# EAGLE design PlantMonitor (EAGLE 8.3.2)
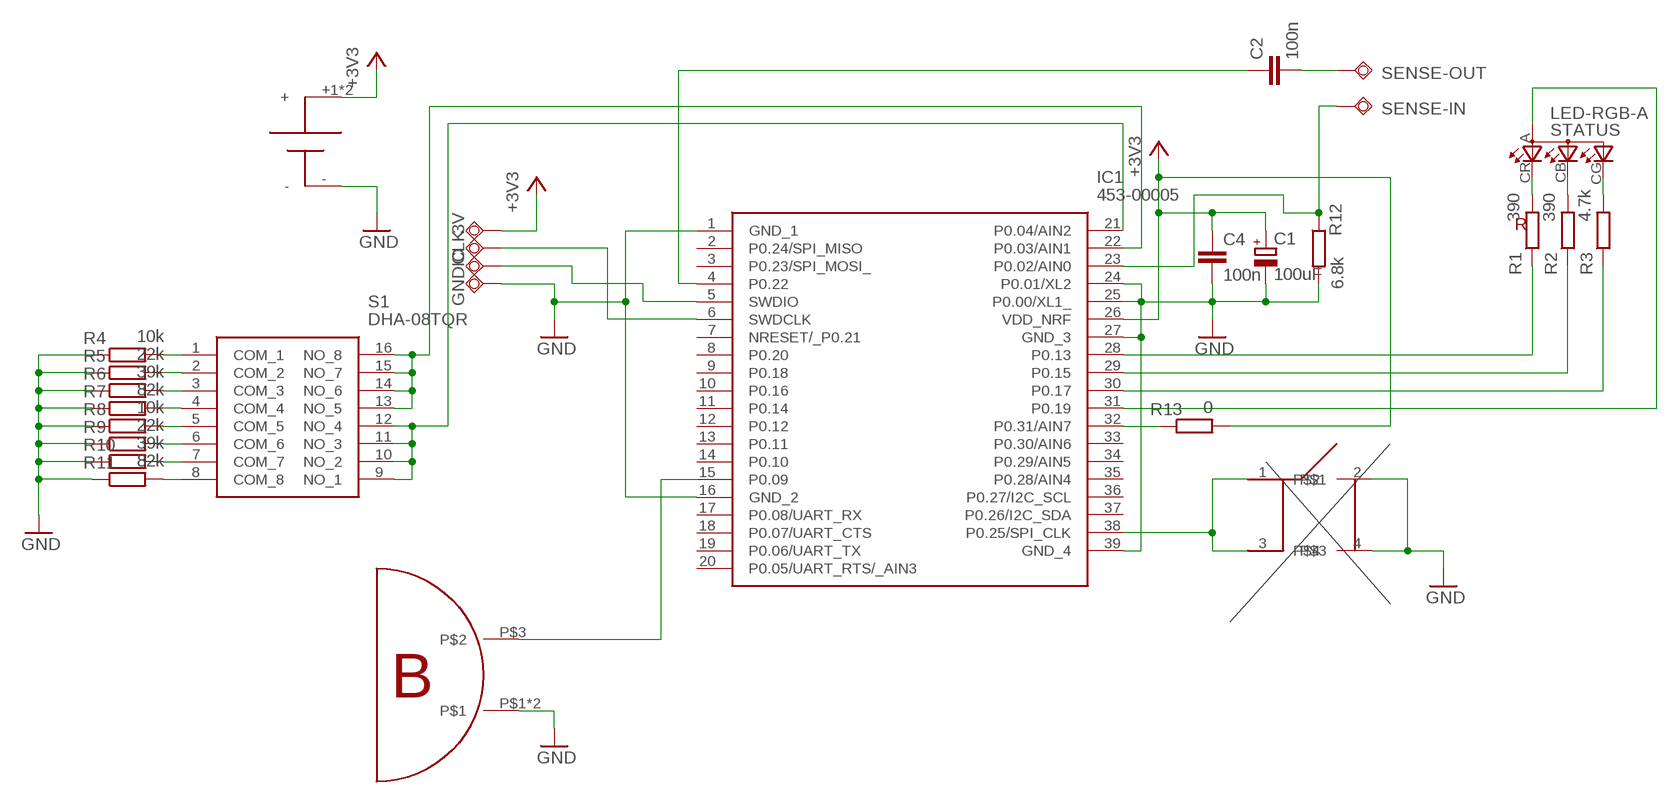
[diagram p0: schematic, sheet 1]

## Parts
3V  TPSQB1,27  [B1,27]
C1  100uF  CPOL-EUA/3216-18W  [A/3216-18W]
C2  100n  C-EUC0603K  [C0603K]
C4  100n  C-EUC0603K  [C0603K]
CLK  TPSQB1,27  [B1,27]
GND  TPSQB1,27  [B1,27]
IC1  453-00005  [45300005]
IO  TPSQB1,27  [B1,27]
R1  390  R-EU_R0603  [R0603]
R2  390  R-EU_R0603  [R0603]
R3  4.7k  R-EU_R0603  [R0603]
R4  10k  R-EU_R0603  [R0603]
R5  22k  R-EU_R0603  [R0603]
R6  39k  R-EU_R0603  [R0603]
R7  82k  R-EU_R0603  [R0603]
R8  10k  R-EU_R0603  [R0603]
R9  22k  R-EU_R0603  [R0603]
R10  39k  R-EU_R0603  [R0603]
R11  82k  R-EU_R0603  [R0603]
R12  6.8k  R-EU_R0603  [R0603]
R13  0  R-EU_R0603  [R0603]
S1  DHA-08TQR  [SOIC127P810X230-16N]
SENSE-IN  TPSQB1,27  [B1,27]
SENSE-OUT  TPSQB1,27  [B1,27]
STATUS  LED-RGB-A  [LED-RGB-A]
U$1  PTS525SK08SMTR2LFS  [PTS525SK08SMTR2LFS]
U$2  COIN-CELL-HOLDER  [COIN-CELL-HOLDER]
U$3  MICRO-BUZZER  [MICRO-BUZZER]

## Nets
+3V3: 3V.TP C1.+ C4.1 IC1.26(VDD_NRF) R13.2 U$2.+1(+) U$2.+2(+)
GND: C1.- C4.2 GND.TP IC1.1(GND_1) IC1.16(GND_2) IC1.24(P0.01/XL2) IC1.25(P0.00/XL1_) IC1.27(GND_3) IC1.39(GND_4) R4.1 R5.1 R6.1 R7.1 R8.1 R9.1 R10.1 R11.1 R12.2 U$1.2 U$1.4 U$2.- U$3.P$1 U$3.P$2
LED-VCC: IC1.31(P0.19) STATUS.A
N$1: IC1.15(P0.09) U$3.P$3
N$2: IC1.5(SWDIO) IO.TP
N$3: CLK.TP IC1.6(SWDCLK)
N$4: IC1.22(P0.03/AIN1) S1.13(NO_5) S1.14(NO_6) S1.15(NO_7) S1.16(NO_8)
N$5: IC1.21(P0.04/AIN2) S1.9(NO_1) S1.10(NO_2) S1.11(NO_3) S1.12(NO_4)
N$6: R4.2 S1.1(COM_1)
N$7: R5.2 S1.2(COM_2)
N$8: R6.2 S1.3(COM_3)
N$9: R7.2 S1.4(COM_4)
N$10: R8.2 S1.5(COM_5)
N$11: R9.2 S1.6(COM_6)
N$12: IC1.38(P0.25/SPI_CLK) U$1.1 U$1.3
N$13: R10.2 S1.7(COM_7)
N$14: R3.2 STATUS.CG(CGREEN)
N$15: R1.2 STATUS.CR(CRED)
N$16: C2.1 IC1.4(P0.22)
N$17: R11.2 S1.8(COM_8)
N$18: IC1.32(P0.31/AIN7) R13.1
N$22: R2.2 STATUS.CB(CBLUE)
N$24: IC1.29(P0.15) R2.1
N$25: IC1.28(P0.13) R1.1
N$26: IC1.30(P0.17) R3.1
SENSE-IN: IC1.23(P0.02/AIN0) R12.1 SENSE-IN.TP
SENSE-OUT: C2.2 SENSE-OUT.TP
Unconnected: IC1.2(P0.24/SPI_MISO) IC1.3(P0.23/SPI_MOSI_) IC1.7(NRESET/_P0.21) IC1.8(P0.20) IC1.9(P0.18) IC1.10(P0.16) IC1.11(P0.14) IC1.12(P0.12) IC1.13(P0.11) IC1.14(P0.10) IC1.17(P0.08/UART_RX) IC1.18(P0.07/UART_CTS) IC1.19(P0.06/UART_TX) IC1.20(P0.05/UART_RTS/_AIN3) IC1.33(P0.30/AIN6) IC1.34(P0.29/AIN5) IC1.35(P0.28/AIN4) IC1.36(P0.27/I2C_SCL) IC1.37(P0.26/I2C_SDA)

## Notes on the sheet
- R

## Library data of the parts
3V CLK GND IO SENSE-IN SENSE-OUT = testpad:TPSQ: Test pad
C1 = rcl:CPOL-EU: POLARIZED CAPACITOR, European symbol; SPICEPREFIX: C
C2 C4 = rcl:C-EU: CAPACITOR, European symbol
IC1 = SamacSys_Parts:453-00005: Bluetooth Modules (802.15.1) BL651 Series - Bluetooth v5 Module, Int. Antenna (Nordic nRF52810) Tape & Reel Source: Datasheet <https://componentsearchengine.com/Datasheets/1/453-00005.pdf>; DESCRIPTION: Bluetooth Modules (802.15.1) BL651 Series - Bluetooth v5 Module, Int. Antenna (Nordic nRF52810) Tape & Reel; HEIGHT: 2.2mm; MANUFACTURER_NAME: Laird Connectivity; MANUFACTURER_PART_NUMBER: 453-00005; MOUSER_PART_NUMBER: 239-453-00005; MOUSER_PRICE-STOCK: https://www.mouser.co.uk/ProductDetail/Laird-Connectivity/453-00005?qs=qSfuJ%252Bfl%2Fd5%2Fxfc9ubfR9w%3D%3D
R1-R13 = rcl:R-EU_: RESISTOR, European symbol
S1 = SamacSys_Parts:DHA-08TQR: DIP Switches / SIP Switches Half Pitch Dip switch 2.2mm height Source: Datasheet <https://www.mouser.co.uk/datasheet/2/910/881_DHA-1571619.pdf>; DESCRIPTION: DIP Switches / SIP Switches Half Pitch Dip switch 2.2mm height; HEIGHT: 2.3mm; MANUFACTURER_NAME: Diptronics; MANUFACTURER_PART_NUMBER: DHA-08TQR; MOUSER_PART_NUMBER: 113-DHA08TQR; MOUSER_PRICE-STOCK: https://www.mouser.com/Search/Refine.aspx?Keyword=113-DHA08TQR
STATUS = STLib:LED-RGB-A: Chip LED RGB Source: http://document.sharpsma.com/files/GM1WA55311A_SS.pdf
U$1 = PTS525SK08SMTR2LFS:PTS525SK08SMTR2LFS
U$2 = STLib:COIN-CELL-HOLDER
U$3 = STLib:MICRO-BUZZER

## Board
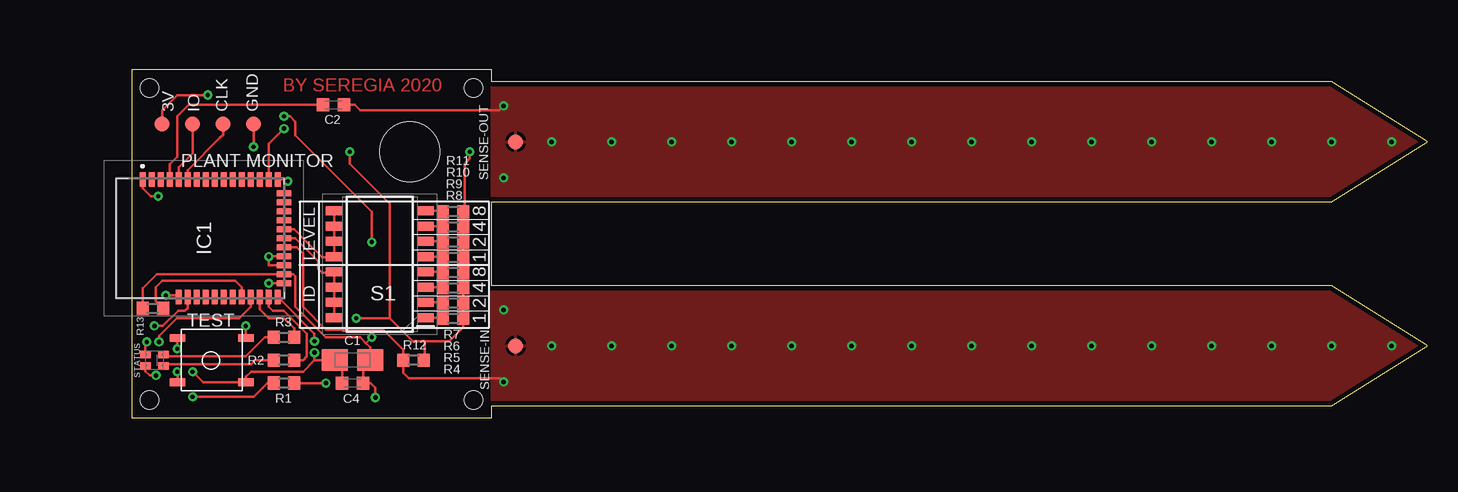
[diagram p1: board, top side]
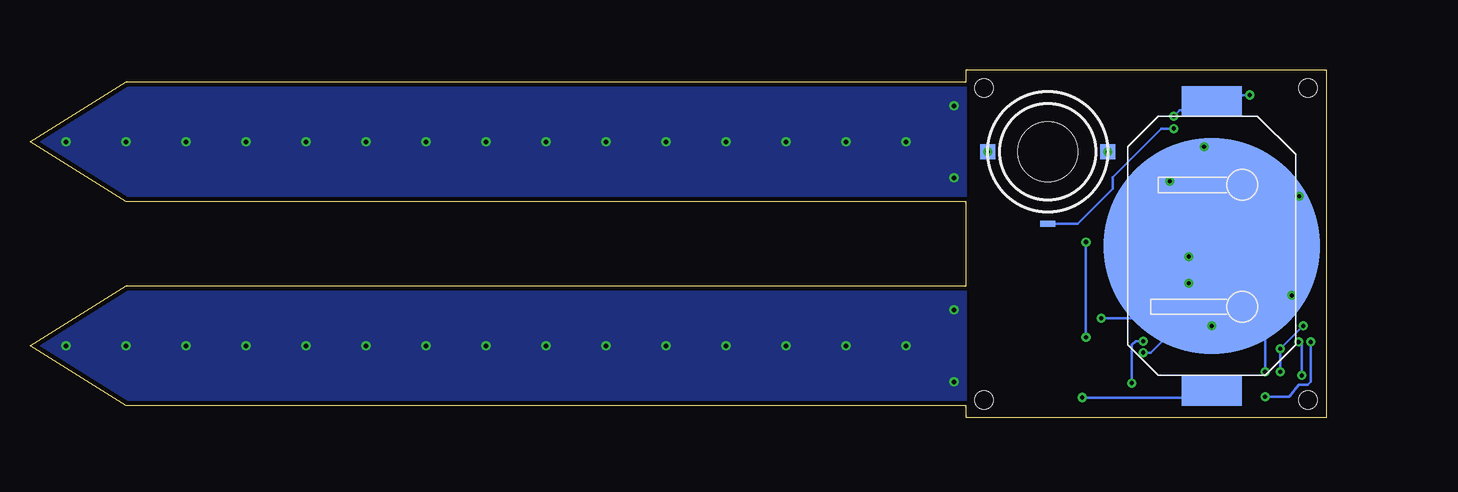
[diagram p2: board, bottom side, seen from below]

Size 108 x 29 mm. Coordinates in mm from the lower left corner, seen from the top.
Outline: 0,0 30,0 30,1 100,1 108,6 100,11 30,11 30,18 100,18 108,23 100,28 30,28 30,29 0,29 0,0
Copper layers (1*16): Top 0.035mm / dielectric 1.5mm / Bottom 0.035mm
Design rules "default *": minimum track width 6mil, minimum drill 0.2mm, track to track 5mil, track to pad 5mil, pad to pad 5mil, via to via 5mil, smd to smd 6mil, copper to edge 0.4mm, drill to drill 6mil, minimum pad ring 10mil, minimum via ring 8mil, stop-mask expansion 4mil, vias tented up to drill 0mil, thermal gap 10mil
Holes 1.5 mm at 1.5,27.5 28.5,27.5 28.5,1.5 1.5,1.5

### Footprints (pad centres in the part's own frame; a part is rotated, then mirrored left to right if it is on the bottom)
B1,27 = smd 1.27 x 1.27: TP 0,0
A/3216-18W = smd 2.15 x 1.8: + 1.475,0; - -1.475,0
C0603K = smd 1.05 x 1.08: 1 -0.875,0; 2 0.875,0
45300005 = smd 1.2 x 0.5: 1 4.9,4.8; 2 4.9,4.05; 3 4.9,3.3; 4 4.9,2.55; 5 4.9,1.8; 6 4.9,1.05; 7 4.9,0.3; 8 4.9,-0.45; 9 4.9,-1.2; 10 4.9,-1.95; 11 4.9,-2.7; 12 4.9,-3.45; 13 4.9,-4.2; 14 4.9,-4.95; 15 4.9,-5.7; 16 4.9,-6.45; 28 -4.9,-6.45; 29 -4.9,-5.7; 30 -4.9,-4.95; 31 -4.9,-4.2; 32 -4.9,-3.45; 33 -4.9,-2.7; 34 -4.9,-1.95; 35 -4.9,-1.2; 36 -4.9,-0.45; 37 -4.9,0.3; 38 -4.9,1.05; 39 -4.9,1.8 | smd 0.5 x 1.2: 17 3.75,-7; 18 3,-7; 19 2.25,-7; 20 1.5,-7; 21 0.75,-7; 22 0,-7; 23 -0.75,-7; 24 -1.5,-7; 25 -2.25,-7; 26 -3,-7; 27 -3.75,-7
R0603 = smd 1 x 1.1: 1 -0.85,0; 2 0.85,0
SOIC127P810X230-16N = smd 1.4 x 0.75: 1 -3.8,4.445; 2 -3.8,3.175; 3 -3.8,1.905; 4 -3.8,0.635; 5 -3.8,-0.635; 6 -3.8,-1.905; 7 -3.8,-3.175; 8 -3.8,-4.445; 9 3.8,-4.445; 10 3.8,-3.175; 11 3.8,-1.905; 12 3.8,-0.635; 13 3.8,0.635; 14 3.8,1.905; 15 3.8,3.175; 16 3.8,4.445
LED-RGB-A = smd 0.635 x 0.889: A 0.475,-0.748; CB 0.475,0.748; CG -0.475,0.748; CR -0.475,-0.748
PTS525SK08SMTR2LFS = smd 1.27 x 0.635: 1 -0.3,4.4; 2 5.4,4.4; 3 -0.3,0.7; 4 5.4,0.7
COIN-CELL-HOLDER = smd 2.5 x 5: +1 12.065,0; +2 -12.065,0 | smd 18 x 18: - 0,0
MICRO-BUZZER = smd 1.27 x 1.27: P$1 -5,0; P$2 5,0 | smd 1.27 x 0.508: P$3 0,6 | hole 5: 0,0

### Placement (x,y rotation side)
3V  2.54,24.5 0 top
C1  18.41,4.81 0 top
C2  16.83,26.08 0 top
C4  18.41,2.91 180 top
CLK  7.62,24.5 0 top
GND  10.16,24.5 0 top
IC1  5.71,14.97 90 top
IO  5.08,24.5 0 top
R1  12.7,2.91 180 top
R2  12.7,4.81 180 top
R3  12.7,6.71 180 top
R4  26.8,8.3 180 top
R5  26.8,9.57 180 top
R6  26.8,10.84 180 top
R7  26.8,12.11 180 top
R8  26.8,13.38 180 top
R9  26.8,14.65 180 top
R10  26.8,15.92 180 top
R11  26.8,17.19 180 top
R12  23.5,4.81 0 top
R13  1.78,9.13 180 top
S1  20.69,12.8 180 top
SENSE-IN  32,6 0 top
SENSE-OUT  32,23 0 top
STATUS  1.91,4.81 270 top
U$1  4.13,2.27 0 top
U$2  9.53,14.34 270 bottom
U$3  23.18,22.19 180 bottom

### Tracks (layer width: path | path; a pad name or v marks a point on that pad's centre or on a via)
+3V3  (via drill 0.35)
  Top 0.203: 19.53,6.24 19.05,6.71 16.19,6.71 13.65,9.26 13.65,11.79 13.48,11.97 IC1.26 2.08,11.97 0.93,10.82 R13.2 | 19.53,6.24 19.89,5.88 C1.+ 19.29,4.81 C4.1 19.94,2.91 20.32,2.52 v20.32,1.7 | v20,14.65 20,17.19 13.65,23.54 13.65,24.69 13.21,25.13 v12.7,25.13 | v20,6.71 19.53,6.24 | 3V.TP 2.54,25.64 3.81,26.91 v6.35,26.91
  Bottom 0.203: U$2.+1 9.53,1.7 v20.32,1.7 | v20,6.71 v20,14.65 | v6.35,26.91 7.62,26.91 7.87,26.4 U$2.+2 9.53,25.64 12.19,25.64 v12.7,25.13
GND  (via drill 0.35)
  Top 0.203: IC1.16 13.02,19.87 v13.02,19.73 | 15.24,4.81 14.29,3.86 9.97,3.86 9.53,3.42 U$1.4 5.97,2.97 v5.08,3.86 | C4.2 17.54,4.81 C1.- 15.24,4.81 | U$1.2 v9.53,7.67 | IC1.39 3.92,10.21 v2.86,10.21 | 15.24,4.81 v15.24,5.45 | IC1.1 0.92,19.14 1.59,18.46 v2.22,18.46 | R12.2 24.45,4.81 24.45,6.4 | GND.TP v10.16,22.59 | U$3.P$2 28.18,21.64 27.75,21.13 27.75,17.19 R11.1 R10.1 R9.1 R8.1 R7.1 R6.1 R5.1 R4.1 27.65,7.57 26.48,6.4 24.45,6.4 | v18.73,8.3 21.53,8.3 | U$3.P$1 18.18,21.17 21.53,17.83 21.53,8.3 | 21.53,8.3 23.43,6.4 24.45,6.4 | IC1.25 11.43,12.72 v11.43,13.45 11.43,13.47 IC1.24 | IC1.27 v11.43,11.22
  Bottom 0.203: U$2.- v13.02,19.73 12.06,20.37 v10.16,22.59 | U$2.- arc-30 v2.86,10.21 5.08,8.3 v5.08,3.86 | U$2.- 8.98,13.36 v9.53,7.67 | 8.89,12.75 U$2.- | v11.43,11.22 8.89,11.48 U$2.- | v2.22,18.46 1.59,14.34 U$2.- | 10.79,13.06 U$2.- | 10.79,13.06 15.56,8.3 v18.73,8.3 | v11.43,13.45 10.79,13.45 10.79,13.06 | U$2.- 9.53,10.53 14.61,5.45 v15.24,5.45
  other vias: 28.18,22.19 18.18,22.19
LED-VCC  (via drill 0.35)
  Top 0.203: IC1.31 9.91,9.26 8.95,8.3 3.75,8.3 2.29,6.84 v2.29,6.33 | v2.03,3.54 1.52,3.54 1.16,3.91 STATUS.A
  Bottom 0.203: v2.03,3.54 2.03,6.08 v2.29,6.33
N$1  (via drill 0.35)
  Top 0.203: v12.7,24.11 11.41,22.83 IC1.15
  Bottom 0.203: U$3.P$3 20.69,16.19 17.78,19.1 17.78,20.05 13.72,24.11 v12.7,24.11
N$2
  Top 0.203: IC1.5 3.92,20.88 5.08,22.04 IO.TP
N$3
  Top 0.203: IC1.6 4.67,20.65 7.37,23.35 7.62,23.61 CLK.TP
N$4
  Top 0.203: IC1.22 13.65,14.97 15.56,13.06 15.56,12.43 15.88,12.11 16.89,12.11 S1.13 S1.14 S1.15 S1.16
N$5
  Top 0.203: IC1.21 13.54,15.72 14.61,14.65 15.88,13.38 16.89,13.38 S1.12 S1.11 S1.10 S1.9
N$6
  Top 0.203: S1.1 25.95,8.36 R4.2
N$7
  Top 0.203: S1.2 25.95,9.63 R5.2
N$8
  Top 0.203: S1.3 25.95,10.9 R6.2
N$9
  Top 0.203: S1.4 25.95,12.17 R7.2
N$10
  Top 0.203: S1.5 25.95,13.44 R8.2
N$11
  Top 0.203: S1.6 25.95,14.71 R9.2
N$12  (via drill 0.35)
  Top 0.203: U$1.3 3.83,3.84 v3.81,3.86 | v3.81,5.76 3.81,6.65 U$1.1 | IC1.38 4.67,9.16 4.45,8.94 3.87,8.94 2.6,7.67 v1.91,7.67
  Bottom 0.203: v3.81,3.86 v3.81,5.76 v1.91,7.67
N$13
  Top 0.203: S1.7 25.95,15.98 R10.2
N$14
  Top 0.203: R3.2 11.11,6.71 9.53,5.13 2.65,5.13 STATUS.CG
N$15  (via drill 0.35)
  Top 0.203: R1.2 11.3,2.91 10.92,2.52 10.16,1.76 v5.08,1.76 | v1.27,6.33 1.16,6.22 STATUS.CR
  Bottom 0.203: v1.27,6.33 1.27,3.03 1.52,2.78 2.29,2.78 3.05,1.76 v5.08,1.76
N$16
  Top 0.203: IC1.4 3.17,21.12 3.81,21.77 3.81,25.13 4.76,26.08 C2.1
N$17
  Top 0.203: S1.8 25.95,17.25 R11.2
N$18
  Top 0.203: IC1.32 9.16,10.88 8.64,11.41 2.54,11.41 2.03,10.91 2.03,9.72 R13.1
N$22
  Top 0.203: STATUS.CB 2.65,4.49 9.97,4.49 10.29,4.81 R2.2
N$24
  Top 0.203: R2.1 14.29,4.81 14.61,5.13 14.61,7.03 12.7,8.94 11.75,8.94 11.43,9.26 11.43,10.05 IC1.29
N$25  (via drill 0.35)
  Top 0.203: R1.1 v16.19,2.91 | IC1.28 12.2,10.07 15.24,7.03 v15.24,6.4
  Bottom 0.203: v16.19,2.91 16.19,6.08 15.88,6.4 v15.24,6.4
N$26
  Top 0.203: R3.1 13.55,7.45 12.7,8.3 11.43,8.3 10.66,9.07 IC1.30
SENSE-IN  (via drill 0.35)
  Top 0.203: IC1.23 13.77,14.22 14.29,13.7 14.29,9.26 16.19,7.35 20.95,7.35 22.64,5.66 R12.1 22.64,3.75 23.11,3.29 30.71,3.29 v31,3 | SENSE-IN.TP 31.76,5.76
  other vias: 35,6 31,9 40,6 45,6 50,6 55,6 60,6 65,6 70,6 75,6 80,6 85,6 90,6 95,6 100,6 105,6
  pour Top: 30,11 100,11 108,6 100,1 30,1
  pour Bottom: 30,11 100,11 108,6 100,1 30,1
SENSE-OUT  (via drill 0.35)
  Top 0.203: 31,26.08 v31,26 30.64,25.64 19.05,25.64 18.61,26.08 C2.2
  other vias: 31,20 35,23 40,23 45,23 50,23 55,23 60,23 65,23 70,23 75,23 80,23 85,23 90,23 95,23 100,23 105,23
  pour Top: 30,28 100,28 108,23 100,18 30,18
  pour Bottom: 30,28 100,28 108,23 100,18 30,18

### Text on the board
Top: BY SEREGIA 2020
tNames: PLANT MONITOR | LEVEL | 1 2 4 8 | ID | TEST | 1 2 4 8